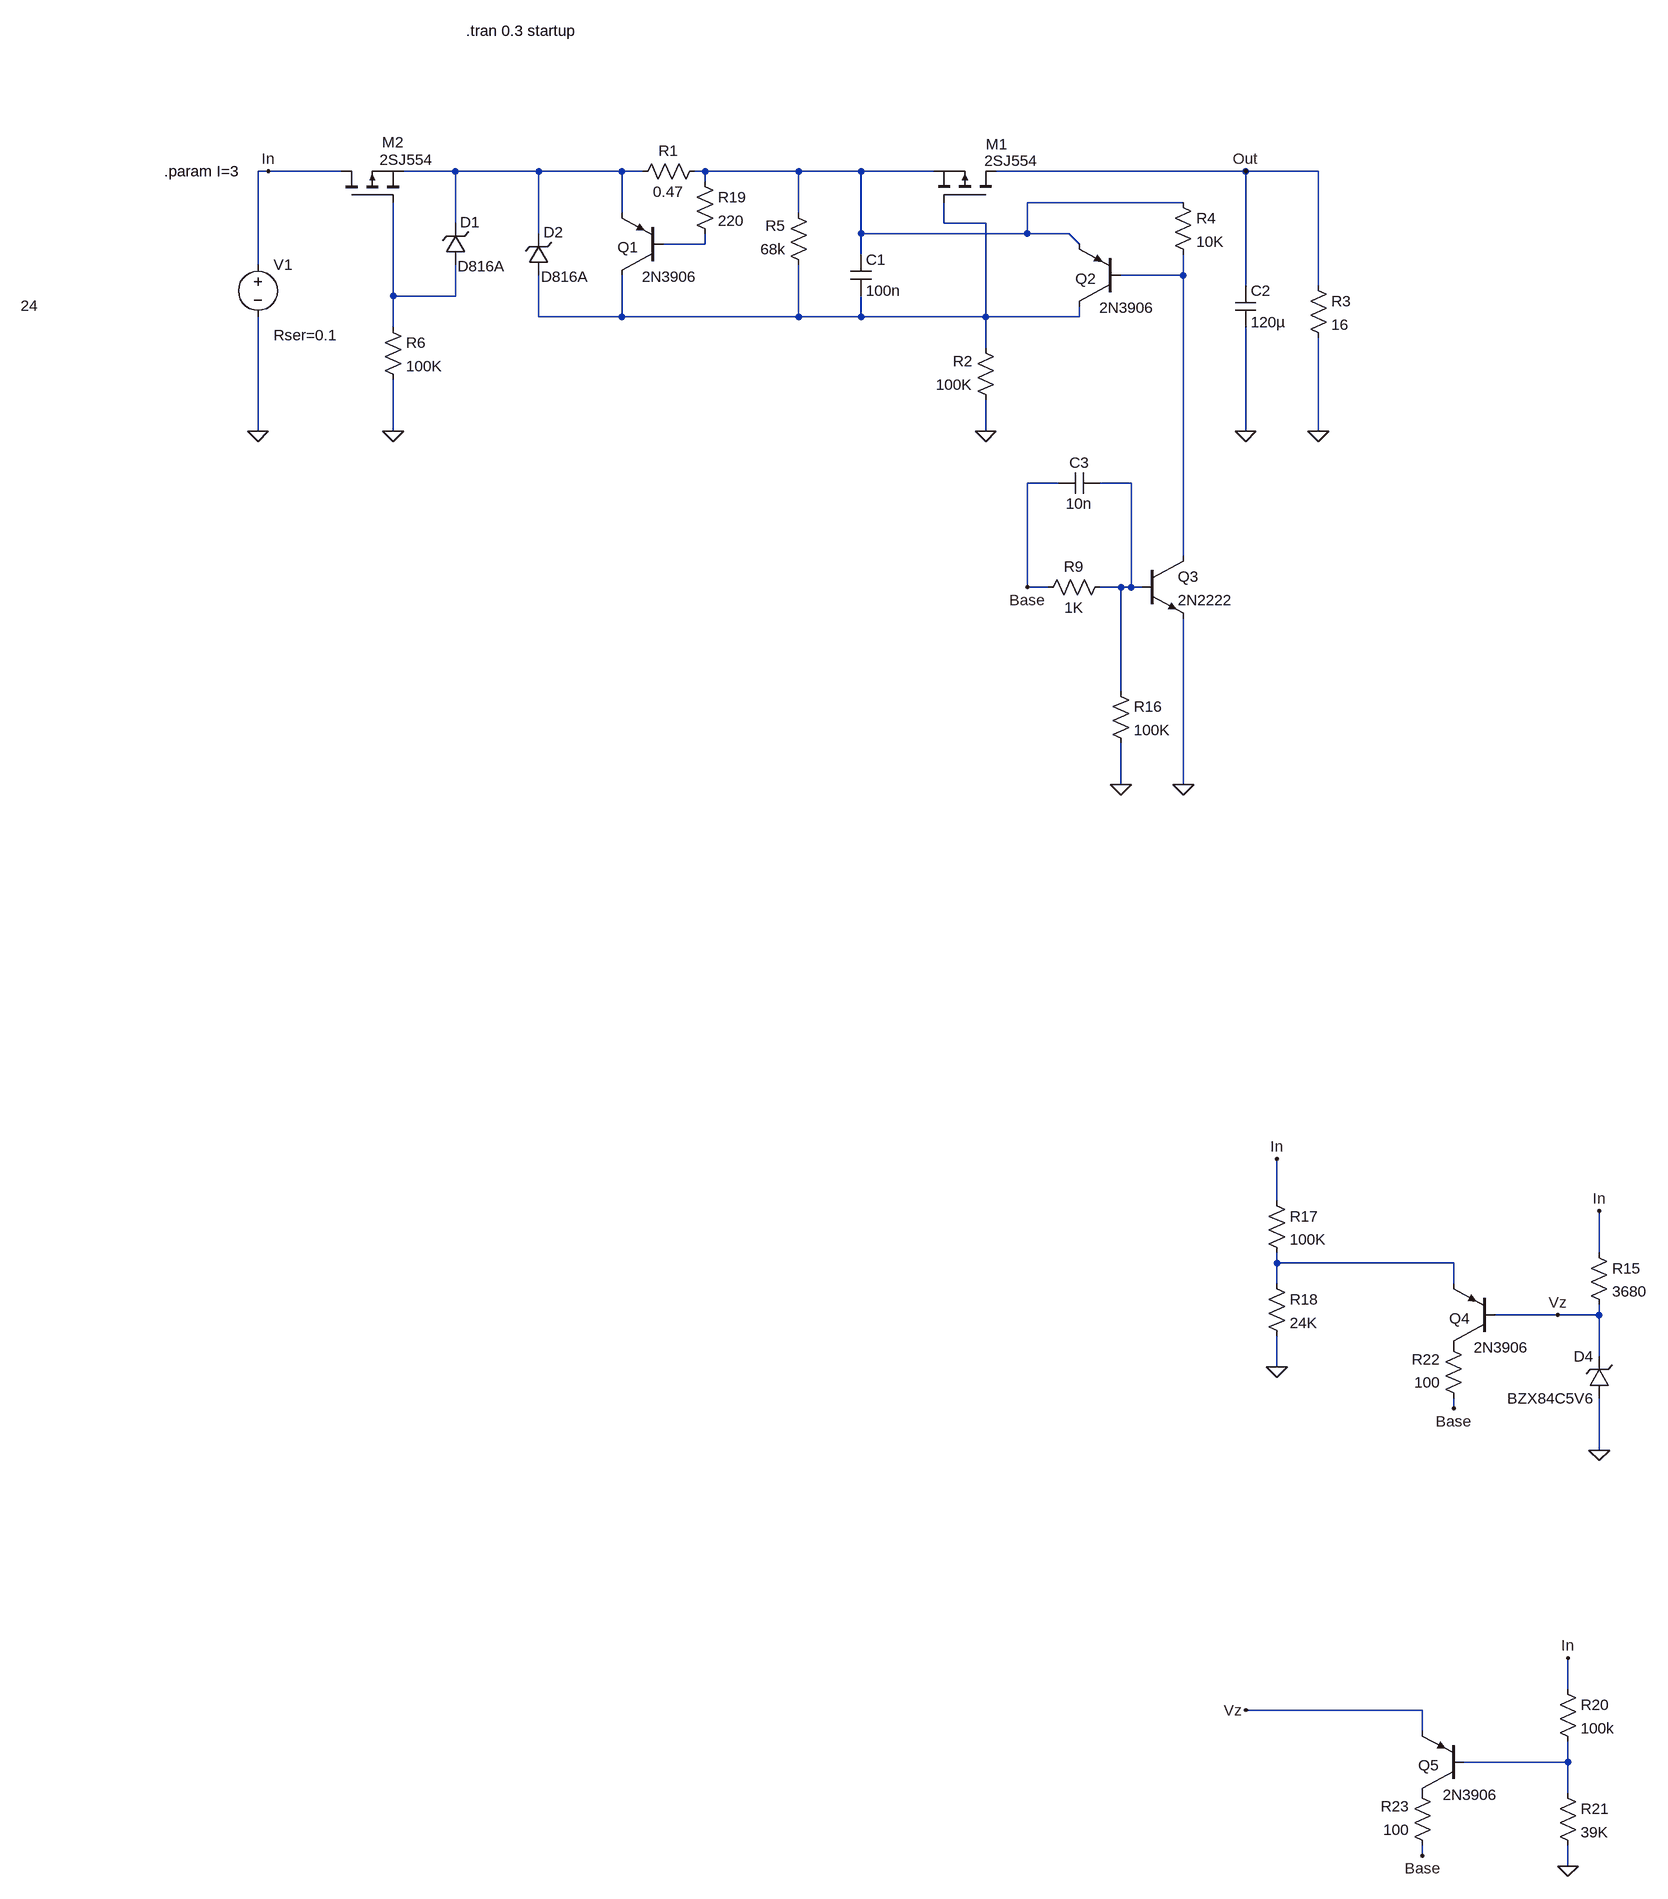
[diagram p0: schematic Input switch.asc]
Input switch.asc, the LTspice schematic file:
Version 4
SHEET 1 1716 2692
WIRE -432 0 -448 0
WIRE -320 0 -432 0
WIRE -144 0 -224 0
WIRE -16 0 -144 0
WIRE 112 0 -16 0
WIRE 144 0 112 0
WIRE 240 0 224 0
WIRE 384 0 240 0
WIRE 480 0 384 0
WIRE 592 0 480 0
WIRE 1072 0 688 0
WIRE 1184 0 1072 0
WIRE 240 16 240 0
WIRE 976 48 736 48
WIRE 112 64 112 0
WIRE 384 64 384 0
WIRE -144 80 -144 0
WIRE 608 80 608 48
WIRE 672 80 608 80
WIRE -16 96 -16 0
WIRE 480 96 480 0
WIRE 736 96 736 48
WIRE 736 96 480 96
WIRE 800 96 736 96
WIRE 240 112 240 96
WIRE 240 112 176 112
WIRE 816 112 800 96
WIRE 480 128 480 96
WIRE -448 144 -448 0
WIRE 976 160 976 128
WIRE 976 160 880 160
WIRE 1072 176 1072 0
WIRE 1184 176 1184 0
WIRE -240 192 -240 48
WIRE -144 192 -144 144
WIRE -144 192 -240 192
WIRE -16 224 -16 160
WIRE 112 224 112 160
WIRE 112 224 -16 224
WIRE 384 224 384 144
WIRE 384 224 112 224
WIRE 480 224 480 192
WIRE 480 224 384 224
WIRE 672 224 672 80
WIRE 672 224 480 224
WIRE 816 224 816 208
WIRE 816 224 672 224
WIRE -240 240 -240 192
WIRE 672 272 672 224
WIRE -448 400 -448 224
WIRE -240 400 -240 320
WIRE 672 400 672 352
WIRE 1072 400 1072 240
WIRE 1184 400 1184 256
WIRE 784 480 736 480
WIRE 896 480 848 480
WIRE 976 592 976 160
WIRE 736 640 736 480
WIRE 768 640 736 640
WIRE 880 640 848 640
WIRE 896 640 896 480
WIRE 896 640 880 640
WIRE 912 640 896 640
WIRE 880 800 880 640
WIRE 880 944 880 880
WIRE 976 944 976 688
WIRE 1120 1584 1120 1520
WIRE 1616 1664 1616 1600
WIRE 1120 1680 1120 1664
WIRE 1392 1680 1120 1680
WIRE 1120 1712 1120 1680
WIRE 1392 1712 1392 1680
WIRE 1552 1760 1456 1760
WIRE 1616 1760 1616 1744
WIRE 1616 1760 1552 1760
WIRE 1616 1824 1616 1760
WIRE 1120 1840 1120 1792
WIRE 1392 1904 1392 1888
WIRE 1616 1968 1616 1888
WIRE 1568 2336 1568 2288
WIRE 1344 2368 1072 2368
WIRE 1344 2400 1344 2368
WIRE 1568 2448 1568 2416
WIRE 1568 2448 1408 2448
WIRE 1568 2496 1568 2448
WIRE 1344 2592 1344 2576
WIRE 1568 2608 1568 2576
FLAG -448 400 0
FLAG 672 400 0
FLAG 1184 400 0
FLAG 1072 400 0
FLAG -240 400 0
FLAG 1072 0 Out
FLAG 976 944 0
FLAG -432 0 In
FLAG 880 944 0
FLAG 1616 1600 In
FLAG 1616 1968 0
FLAG 1120 1520 In
FLAG 1120 1840 0
FLAG 736 640 Base
FLAG 1392 1904 Base
FLAG 1344 2592 Base
FLAG 1568 2288 In
FLAG 1568 2608 0
FLAG 1552 1760 Vz
FLAG 1072 2368 Vz
SYMBOL voltage -448 128 R0
WINDOW 123 0 0 Left 0
WINDOW 39 24 124 Left 2
WINDOW 3 -365 79 Left 2
SYMATTR SpiceLine Rser=0.1
SYMATTR Value 24
SYMATTR InstName V1
SYMBOL res 240 -16 R90
WINDOW 0 0 56 VBottom 2
WINDOW 3 32 56 VTop 2
SYMATTR InstName R1
SYMATTR Value 0.47
SYMBOL res 688 368 R180
WINDOW 0 36 76 Left 2
WINDOW 3 36 40 Left 2
SYMATTR InstName R2
SYMATTR Value 100K
SYMBOL pnp 176 160 R180
WINDOW 0 38 43 Left 2
WINDOW 3 -52 -2 Left 2
SYMATTR InstName Q1
SYMATTR Value 2N3906
SYMBOL cap 1056 176 R0
SYMATTR InstName C2
SYMATTR Value 120µ
SYMBOL cap 464 128 R0
SYMATTR InstName C1
SYMATTR Value 100n
SYMBOL pmos 688 48 M270
WINDOW 0 90 16 VLeft 2
WINDOW 3 64 18 VLeft 2
SYMATTR InstName M1
SYMATTR Value 2SJ554
SYMBOL res 1168 160 R0
SYMATTR InstName R3
SYMATTR Value 16
SYMBOL pmos -320 48 R270
WINDOW 0 93 63 VRight 2
WINDOW 3 66 59 VRight 2
SYMATTR InstName M2
SYMATTR Value 2SJ554
SYMBOL res -256 224 R0
SYMATTR InstName R6
SYMATTR Value 100K
SYMBOL zener -128 144 R180
WINDOW 0 -22 66 Left 2
WINDOW 3 -61 -2 Left 2
SYMATTR InstName D1
SYMATTR Value D816A
SYMATTR Description Diode
SYMATTR Type diode
SYMBOL pnp 880 208 R180
WINDOW 0 38 43 Left 2
WINDOW 3 -52 -2 Left 2
SYMATTR InstName Q2
SYMATTR Value 2N3906
SYMBOL res 960 32 R0
SYMATTR InstName R4
SYMATTR Value 10K
SYMBOL zener 0 160 R180
WINDOW 0 -22 66 Left 2
WINDOW 3 -61 -2 Left 2
SYMATTR InstName D2
SYMATTR Value D816A
SYMATTR Description Diode
SYMATTR Type diode
SYMBOL npn 912 592 R0
SYMATTR InstName Q3
SYMATTR Value 2N2222
SYMBOL res 864 624 R90
WINDOW 0 0 56 VBottom 2
WINDOW 3 32 56 VTop 2
SYMATTR InstName R9
SYMATTR Value 1K
SYMBOL cap 848 464 R90
WINDOW 0 0 32 VBottom 2
WINDOW 3 32 32 VTop 2
SYMATTR InstName C3
SYMATTR Value 10n
SYMBOL res 864 784 R0
SYMATTR InstName R16
SYMATTR Value 100K
SYMBOL res 1600 1648 R0
SYMATTR InstName R15
SYMATTR Value 3680
SYMBOL zener 1632 1888 R180
WINDOW 0 24 64 Left 2
WINDOW 3 24 0 Left 2
SYMATTR InstName D4
SYMATTR Value BZX84C5V6
SYMATTR Description Diode
SYMATTR Type diode
SYMBOL pnp 1456 1808 R180
WINDOW 0 38 43 Left 2
WINDOW 3 -52 -2 Left 2
SYMATTR InstName Q4
SYMATTR Value 2N3906
SYMBOL res 1104 1568 R0
SYMATTR InstName R17
SYMATTR Value 100K
SYMBOL res 1104 1696 R0
SYMATTR InstName R18
SYMATTR Value 24K
SYMBOL pnp 1408 2496 R180
WINDOW 0 38 43 Left 2
WINDOW 3 -52 -2 Left 2
SYMATTR InstName Q5
SYMATTR Value 2N3906
SYMBOL res 1552 2320 R0
SYMATTR InstName R20
SYMATTR Value 100k
SYMBOL res 1552 2480 R0
SYMATTR InstName R21
SYMATTR Value 39K
SYMBOL res 1408 1904 R180
WINDOW 0 36 76 Left 2
WINDOW 3 36 40 Left 2
SYMATTR InstName R22
SYMATTR Value 100
SYMBOL res 1360 2592 R180
WINDOW 0 36 76 Left 2
WINDOW 3 36 40 Left 2
SYMATTR InstName R23
SYMATTR Value 100
SYMBOL res 400 160 R180
WINDOW 0 36 76 Left 2
WINDOW 3 36 40 Left 2
SYMATTR InstName R5
SYMATTR Value 68k
SYMBOL res 224 0 R0
SYMATTR InstName R19
SYMATTR Value 220
TEXT -128 -216 Left 2 !.tran 0.3 startup
TEXT -592 0 Left 2 !.param I=3

The netlist it stands for:
* Input switch.asc
V1 In 0 24 Rser=0.1
R1 N002 N001 0.47
R2 0 N003 100K
Q1 N003 N004 N001 0 2N3906
C2 Out 0 120µ
C1 N002 N003 100n
M1 Out N003 N002 N002 2SJ554
R3 Out 0 16
M2 In N006 N001 N001 2SJ554
R6 N006 0 100K
D1 N006 N001 D816A
Q2 N003 N005 N002 0 2N3906
R4 N002 N005 10K
D2 N003 N001 D816A
Q3 N005 N007 0 0 2N2222
R9 N007 Base 1K
C3 N007 Base 10n
R16 N007 0 100K
R15 In Vz 3680
D4 0 Vz BZX84C5V6
Q4 P001 Vz N008 0 2N3906
R17 In N008 100K
R18 N008 0 24K
Q5 P002 N009 Vz 0 2N3906
R20 In N009 100k
R21 N009 0 39K
R22 Base P001 100
R23 Base P002 100
R5 N003 N002 68k
R19 N002 N004 220
.model D D
.lib standard.dio
.model NPN NPN
.model PNP PNP
.lib standard.bjt
.model NMOS NMOS
.model PMOS PMOS
.lib standard.mos
.tran 0.3 startup
.param I=3
.backanno
.end